# Altium schematic sheet LDO_Hall.SchDoc
size 420 x 297 mm; Address1: Address1; Address2: Address2; Address3: Address3; Address4: Address4; SheetNumber: 1; Scale: 1:1; Разраб.: Иванов; Обозначение документа: АБВГ.123456.001 Э3; Пров.: Петров; Утв.: Сидоров; Наименование организации: ОАО "Концерн "МПО-Гидроприбор"; Перв. применение: АБВГ.123456.000; Наименование изделия 1: Плата; Наименование изделия 2: Схема электрическая; Наименование изделия 3: принципиальная; Нач. отд.: Нач. отд.; Фамилия нач. отд.: Сидоров
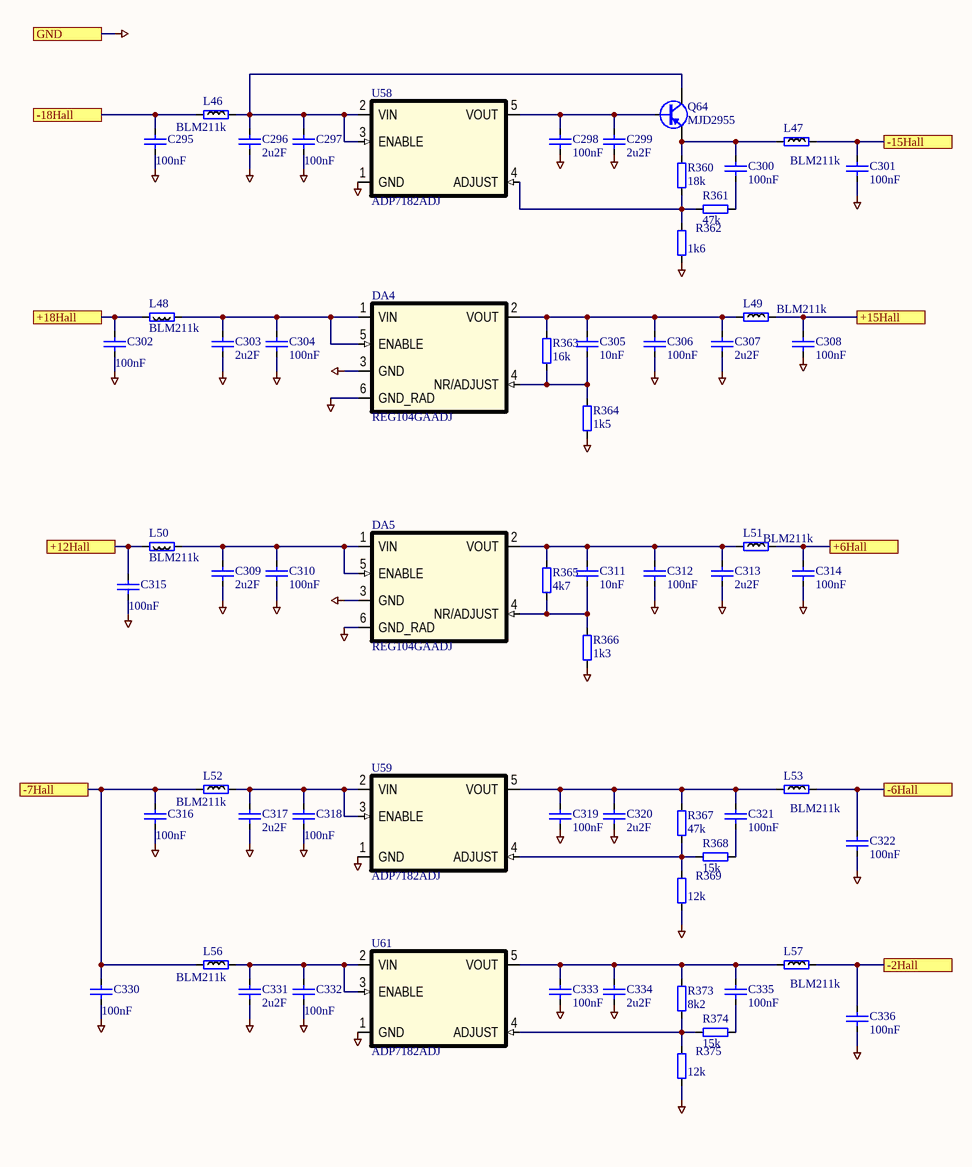
[diagram p0: LDO_Hall.SchDoc]

## Parts
C295  100nF  [SMD0805CAP]
C296  2u2F  [SMD0805CAP]
C297  100nF  [SMD0805CAP]
C298  100nF  [SMD0805CAP]
C299  2u2F  [SMD0805CAP]
C300  100nF  [SMD0805CAP]
C301  100nF  [SMD0805CAP]
C302  100nF  [SMD0805CAP]
C303  2u2F  [SMD0805CAP]
C304  100nF  [SMD0805CAP]
C305  10nF  [SMD0805CAP]
C306  100nF  [SMD0805CAP]
C307  2u2F  [SMD0805CAP]
C308  100nF  [SMD0805CAP]
C309  2u2F  [SMD0805CAP]
C310  100nF  [SMD0805CAP]
C311  10nF  [SMD0805CAP]
C312  100nF  [SMD0805CAP]
C313  2u2F  [SMD0805CAP]
C314  100nF  [SMD0805CAP]
C315  100nF  [SMD0805CAP]
C316  100nF  [SMD0805CAP]
C317  2u2F  [SMD0805CAP]
C318  100nF  [SMD0805CAP]
C319  100nF  [SMD0805CAP]
C320  2u2F  [SMD0805CAP]
C321  100nF  [SMD0805CAP]
C322  100nF  [SMD0805CAP]
C330  100nF  [SMD0805CAP]
C331  2u2F  [SMD0805CAP]
C332  100nF  [SMD0805CAP]
C333  100nF  [SMD0805CAP]
C334  2u2F  [SMD0805CAP]
C335  100nF  [SMD0805CAP]
C336  100nF  [SMD0805CAP]
DA4  REG104GAADJ  [SOT223_6-127]
DA5  REG104GAADJ  [SOT223_6-127]
L46  BLM211k  [RESC2012X50N]
L47  BLM211k  [RESC2012X50N]
L48  BLM211k  [RESC2012X50N]
L49  BLM211k  [RESC2012X50N]
L50  BLM211k  [RESC2012X50N]
L51  BLM211k  [RESC2012X50N]
L52  BLM211k  [RESC2012X50N]
L53  BLM211k  [RESC2012X50N]
L56  BLM211k  [RESC2012X50N]
L57  BLM211k  [RESC2012X50N]
Q64  MJD2955  [DPAK]
R360  18k  [SMD0805RES]
R361  47k  [SMD0805RES]
R362  1k6  [SMD0805RES]
R363  16k  [SMD0805RES]
R364  1k5  [SMD0805RES]
R365  4k7  [SMD0805RES]
R366  1k3  [SMD0805RES]
R367  47k  [SMD0805RES]
R368  15k  [SMD0805RES]
R369  12k  [SMD0805RES]
R373  8k2  [SMD0805RES]
R374  15k  [SMD0805RES]
R375  12k  [SMD0805RES]
U58  ADP7182ADJ  [SOT23-5]
U59  ADP7182ADJ  [SOT23-5]
U61  ADP7182ADJ  [SOT23-5]

## Ports
+6Hall, +12Hall, +15Hall, +18Hall, -2Hall, -6Hall, -7Hall, -15Hall, -18Hall, GND

## Nets
GND: C295.2 C296.2 C297.2 C298.1 C299.1 C301.1 C302.2 C303.1 C304.1 C306.1 C307.1 C308.1 C309.1 C310.1 C312.1 C313.1 C314.1 C315.2 C316.2 C317.2 C318.2 C319.1 C320.1 C322.1 C330.2 C331.2 C332.2 C333.1 C334.1 C336.1 DA4.3(GND) DA4.6(GND_RAD) DA5.3(GND) DA5.6(GND_RAD) R362.1 R364.1 R366.1 R369.1 R375.1 U58.1(GND) U59.1(GND) U61.1(GND) ; port GND
+6Hall: C314.2 L51.1 ; port +6Hall
+12Hall: C315.1 L50.1 ; port +12Hall
+15Hall: C308.2 L49.1 ; port +15Hall
+18Hall: C302.1 L48.1 ; port +18Hall
-2Hall: C336.2 L57.1 ; port -2Hall
-6Hall: C322.2 L53.1 ; port -6Hall
-7Hall: C316.1 C330.1 L52.2 L56.2 ; port -7Hall
-15Hall: C301.2 L47.1 ; port -15Hall
-18Hall: C295.1 L46.2 ; port -18Hall
NetC296_1: C296.1 C297.1 L46.1 Q64.3(C) U58.2(VIN) U58.3(ENABLE)
NetC298_2: C298.2 C299.2 Q64.1(B) U58.5(VOUT)
NetC300_1: C300.1 R361.1
NetC300_2: C300.2 L47.2 Q64.2(E) R360.2
NetC303_2: C303.2 C304.2 DA4.1(VIN) DA4.5(ENABLE) L48.2
NetC305_1: C305.1 DA4.4(NR/ADJUST) R363.1 R364.2
NetC305_2: C305.2 C306.2 C307.2 DA4.2(VOUT) L49.2 R363.2
NetC309_2: C309.2 C310.2 DA5.1(VIN) DA5.5(ENABLE) L50.2
NetC311_1: C311.1 DA5.4(NR/ADJUST) R365.1 R366.2
NetC311_2: C311.2 C312.2 C313.2 DA5.2(VOUT) L51.2 R365.2
NetC317_1: C317.1 C318.1 L52.1 U59.2(VIN) U59.3(ENABLE)
NetC319_2: C319.2 C320.2 C321.2 L53.2 R367.2 U59.5(VOUT)
NetC321_1: C321.1 R368.1
NetC331_1: C331.1 C332.1 L56.1 U61.2(VIN) U61.3(ENABLE)
NetC333_2: C333.2 C334.2 C335.2 L57.2 R373.2 U61.5(VOUT)
NetC335_1: C335.1 R374.1
NetR360_1: R360.1 R361.2 R362.2 U58.4(ADJUST)
NetR367_1: R367.1 R368.2 R369.2 U59.4(ADJUST)
NetR373_1: R373.1 R374.2 R375.2 U61.4(ADJUST)

## Notes on the sheet
- Подп. и дата
- Инв. № дубл.
- Взам. инв. №
- Инв. № подл.
- Изм.
- Лист
- № докум.
- Подп.
- Дата
- Копировал
- Формат А3

## Library data of the parts
C295-C322 C330-C336 = C0805: Чип конденсатор 0805; Voltage: 25V; Vendor: Vishay; DielectricType: X5R; SMD Solders: 2; Solder Option: RM; Tolerance: 20%; Pkg: SMD0805; Device: Cap0805; Price: 2
  C295 C297 C298 C300-C302 C304 C306 C308 C310 C312 C314-C316 C318 C319 C321 C322 C330 C332 C333 C335 C336: Value: 100nF
  C296 C299 C303 C307 C309 C313 C317 C320 C331 C334: Value: 2u2F
  C305 C311: Value: 10nF
DA4 DA5 = REG104GA: Positive LDO Linear stabilizer; Vendor: Texas Instruments; Value: ADJ; SMD Solders: 6; Solder Option: RM; TC: 70ppm/C; Tolerance: +-2% Max; Pkg: SOT223-6; Name to order: REG104GA-A; Vref: 1V295; Price: 1000; Device: REG104GA
L46 L48 L50 L52 L56 = BLM21: SMD Ferrite bead 0805; Vendor: Vishay; Value: 1k; Pkg: SMD0805; SMD Solders: 2; Solder Option: RM; Price: 10; Device: BLM21
L47 L49 L51 L53 L57 = BLM21: SMD Ferrite bead 0805; Vendor: Vishay; Value: 1k; Pkg: SMD0805; SMD Solders: 2; Solder Option: i; Price: 10; Device: BLM21
Q64 = MJD2955: PNP транзистор; Vendor: ON Semiconductor; SMD Solders: 3; Solder Option: RM; Name to order: MJD29G55; Voltage: -60V; Pkg: DPAK; Price: 100; Device: MJD2955
R360 R363 R365 R367 R373 = R0805: Чип резистор 0805; Vendor: Vishay; SMD Solders: 2; Solder Option: RM; TC: 100ppm/C; Tolerance: 1%; Pkg: SMD0805; Pwr: 125mW; Device: Res0805; Price: 2
  R360: Value: 18k
  R363: Value: 16k
  R365: Value: 4k7
  R367: Value: 47k
  R373: Value: 8k2
R361 R362 R364 R366 R368 R369 R374 R375 = R0805: Чип резистор 0805; Vendor: Vishay; SMD Solders: 2; Solder Option: ADJ; TC: 100ppm/C; Tolerance: 1%; Pkg: SMD0805; Pwr: 125mW; Device: Res0805; Price: 2
  R361: Value: 47k
  R362: Value: 1k6
  R364: Value: 1k5
  R366: Value: 1k3
  R368 R374: Value: 15k
  R369 R375: Value: 12k
U58 U59 U61 = ADP7182: Negative LDO Linear stabilizer; Vendor: Analog Devoces; Value: ADJ; SMD Solders: 5; Solder Option: RM; Name to order: ADP7182AUJZ-R7; Vref: 1V22; Pkg: SOT23-5; Price: 100; Device: ADP7182